# EAGLE design Diagrama-esquematico-oscilador-astavel (EAGLE 8.6.0)
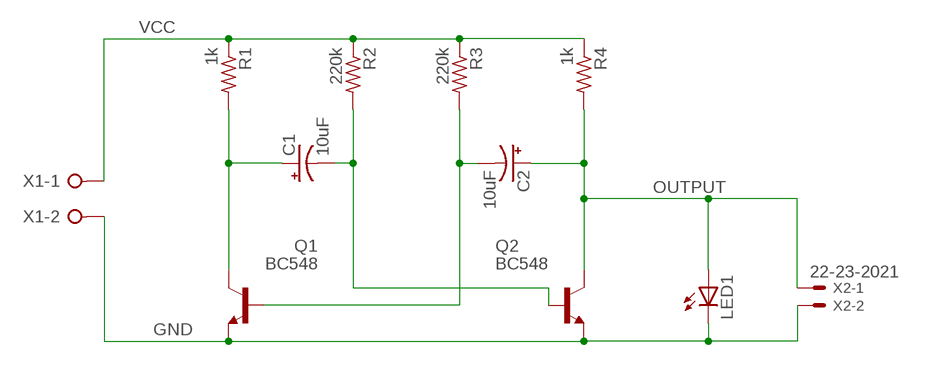
[diagram p0: schematic, sheet 1]

## Parts
C1  10uF  CPOL-USE2-4  [E2-4]
C2  10uF  CPOL-USE2-4  [E2-4]
LED1  LED5MM  [LED5MM]
Q1  BC548  [TO92-EBC]
Q2  BC548  [TO92-EBC]
R1  1k  R-US_0207/10  [0207/10]
R2  220k  R-US_0207/10  [0207/10]
R3  220k  R-US_0207/10  [0207/10]
R4  1k  R-US_0207/10  [0207/10]
X1  W237-02P  [W237-132]
X2  22-23-2021  [22-23-2021]

## Nets
GND: LED1.K(C) Q1.E Q2.E X1.2 X2.2
N$3: C2.- Q1.B R3.2
N$4: C1.+ Q1.C R1.2
N$6: C1.- Q2.B R2.2
OUTPUT: C2.+ LED1.A Q2.C R4.2 X2.1
VCC: R1.1 R2.1 R3.1 R4.1 X1.1

## Library data of the parts
C1 C2 = rcl:CPOL-US: POLARIZED CAPACITOR, American symbol; SPICEPREFIX: C
LED1 = led:LED: LED OSRAM: - CHIPLED LG R971, LG N971, LY N971, LG Q971, LY Q971, LO R971, LY R971 LH N974, LH R974 LS Q976, LO Q976, LY Q976 LO Q996 - Hyper CHIPLED LW Q18S LB Q993, LB Q99A, LB R99A - SideLED LS A670, LO A670, LY A670, LG A670, LP A670 LB A673, LV A673, LT A673, LW A673 LH A674 LY A675 LS A676, LA A676, LO A676, LY A676, LW A676 LS A679, LY A679, LG A679 - Hyper Micro SIDELED® LS Y876, LA Y876, LO Y876, LY Y876 LT Y87S - SmartLED LW L88C, LW L88S LB L89C, LB L89S, LG L890 LS L89K, LO L89K, LY L89K LS L896, LA L896, LO L896, LY L896 - TOPLED LS T670, LO T670, LY T670, LG T670, LP T670 LSG T670, LSP T670, LSY T670, LOP T670, LYG T670 LG T671, LOG T671, LSG T671 LB T673, LV T673, LT T673, LW T673 LH T674 LS T676, LA T676, LO T676, LY T676, LB T676, LH T676, LSB T676, LW T676 LB T67C, LV T67C, LT T67C, LS T67K, LO T67K, LY T67K, LW E67C LS E67B, LA E67B, LO E67B, LY E67B, LB E67C, LV E67C, LT E67C LW T67C LS T679, LY T679, LG T679 LS T770, LO T770, LY T770, LG T770, LP T770 LB T773, LV T773, LT T773, LW T773 LH T774 LS E675, LA E675, LY E675, LS T675 LS T776, LA T776, LO T776, LY T776, LB T776 LHGB T686 LT T68C, LB T68C - Hyper Mini TOPLED® LB M676 - Mini TOPLED Santana® LG M470 LS M47K, LO M47K, LY M47K Source: http://www.osram.convergy.de LUXEON: - LUMILED® LXK2-PW12-R00, LXK2-PW12-S00, LXK2-PW14-U00, LXK2-PW14-V00 LXK2-PM12-R00, LXK2-PM12-S00, LXK2-PM14-U00 LXK2-PE12-Q00, LXK2-PE12-R00, LXK2-PE12-S00, LXK2-PE14-T00, LXK2-PE14-U00 LXK2-PB12-K00, LXK2-PB12-L00, LXK2-PB12-M00, LXK2-PB14-N00, LXK2-PB14-P00, LXK2-PB14-Q00 LXK2-PR12-L00, LXK2-PR12-M00, LXK2-PR14-Q00, LXK2-PR14-R00 LXK2-PD12-Q00, LXK2-PD12-R00, LXK2-PD12-S00 LXK2-PH12-R00, LXK2-PH12-S00 LXK2-PL12-P00, LXK2-PL12-Q00, LXK2-PL12-R00 Source: www.luxeon.com KINGBRIGHT: KA-3528ASYC Source: www.kingbright.com
Q1 Q2 = transistor-npn:BC548*: NPN Transistor
R1-R4 = rcl:R-US_: RESISTOR, American symbol; SPICEPREFIX: R
X1 = con-wago-508:W237-02P: WAGO SREW CLAMP; OC_FARNELL: unknown; OC_NEWARK: unknown
X2 = con-molex:22-23-2021: .100" (2.54mm) Center Header - 2 Pin; MF: MOLEX; MPN: 22-23-2021; OC_FARNELL: 1462926; OC_NEWARK: 25C3832

## Board
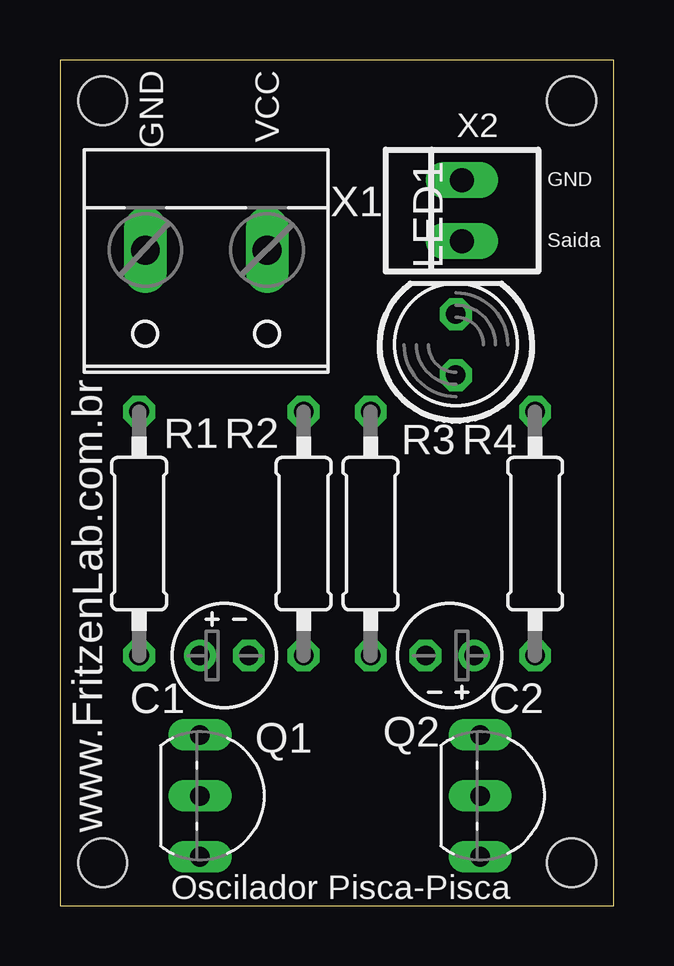
[diagram p1: board, top side]
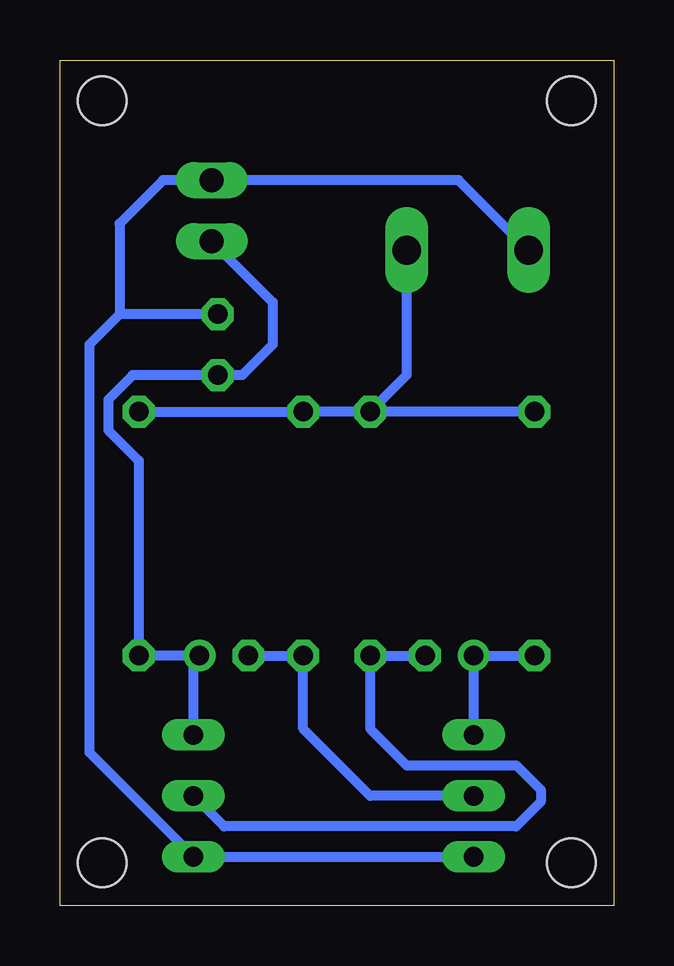
[diagram p2: board, bottom side, seen from below]

Size 23.09 x 35.23 mm. Coordinates in mm from the lower left corner, seen from the top.
Outline: 0,0 23.09,0 23.09,35.23 0,35.23 0,0
Copper layers (1*16): Top 0.035mm / dielectric 1.5mm / Bottom 0.035mm
Design rules "default *": minimum track width 6mil, minimum drill 0.35mm, track to track 12mil, track to pad 12mil, pad to pad 12mil, via to via 12mil, smd to smd 6mil, copper to edge 40mil, drill to drill 6mil, minimum pad ring 10mil, minimum via ring 8mil, stop-mask expansion 4mil, vias tented up to drill 0mil, thermal gap 10mil
Holes 2.03 mm at 1.78,1.78 21.34,1.78 1.78,33.53 21.34,33.53

### Footprints (pad centres in the part's own frame; a part is rotated, then mirrored left to right if it is on the bottom)
E2-4 = drill 0.813 pad 1.27: + -1.016,0 | drill 0.813 pad 1.27 octagon: - 1.016,0
LED5MM = drill 0.813 octagon: A -1.27,0; K 1.27,0
TO92-EBC = drill 0.813 long: B 0,-1.27; C -2.54,-1.27; E 2.54,-1.27
0207/10 = drill 0.813 octagon: 1 -5.08,0; 2 5.08,0
W237-132 = drill 1.194 long: 1 -2.54,-0.635; 2 2.54,-0.635
22-23-2021 = drill 1 long: 1 -1.27,0; 2 1.27,0

### Placement (x,y rotation side)
C1  6.86,10.41 0 top
C2  16.26,10.41 180 top
LED1  16.51,23.37 90 top
Q1  7.11,4.57 270 top
Q2  18.8,4.57 270 top
R1  3.3,15.49 270 top
R2  10.16,15.49 270 top
R3  12.95,15.49 270 top
R4  19.81,15.49 270 top
X1  6.1,26.67 180 top
X2  16.76,28.96 90 top

### Tracks (layer width: path | path; a pad name or v marks a point on that pad's centre or on a via)
GND
  Bottom 0.406: Q1.E Q2.E 21.88,6.38 21.88,23.37 20.61,24.64 | X1.2 6.48,30.23 X2.2 18.8,30.23 20.61,28.42 20.61,24.64 | LED1.K 20.61,24.64
N$3
  Bottom 0.406: C2.- R3.2 12.95,7.37 10.16,4.57 Q1.B
N$4
  Bottom 0.406: R1.2 C1.+ Q1.C
N$6
  Bottom 0.406: C1.- R2.2 10.16,7.37 8.64,5.84 4.06,5.84 3.05,4.83 3.05,4.32 4.06,3.3 16.26,3.3 Q2.B
OUTPUT
  Bottom 0.406: C2.+ 17.53,10.41 | 17.53,10.41 R4.2 19.81,18.54 21.08,19.81 21.08,21.08 20.07,22.1 LED1.A 15.49,22.1 14.22,23.37 14.22,25.15 X2.1 | Q2.C 17.53,10.41
VCC
  Bottom 0.406: R4.1 R3.1 R2.1 | R1.1 R2.1 | X1.1 8.64,22.1 R2.1

### Text on the board
tNames: GND | VCC | GND | Saida | www.FritzenLab.com.br | Oscilador Pisca-Pisca